# Altium schematic sheet DC_Current_Voltage_Measurement.SchDoc
size A4; SheetNumber: 8; SheetTotal: 10
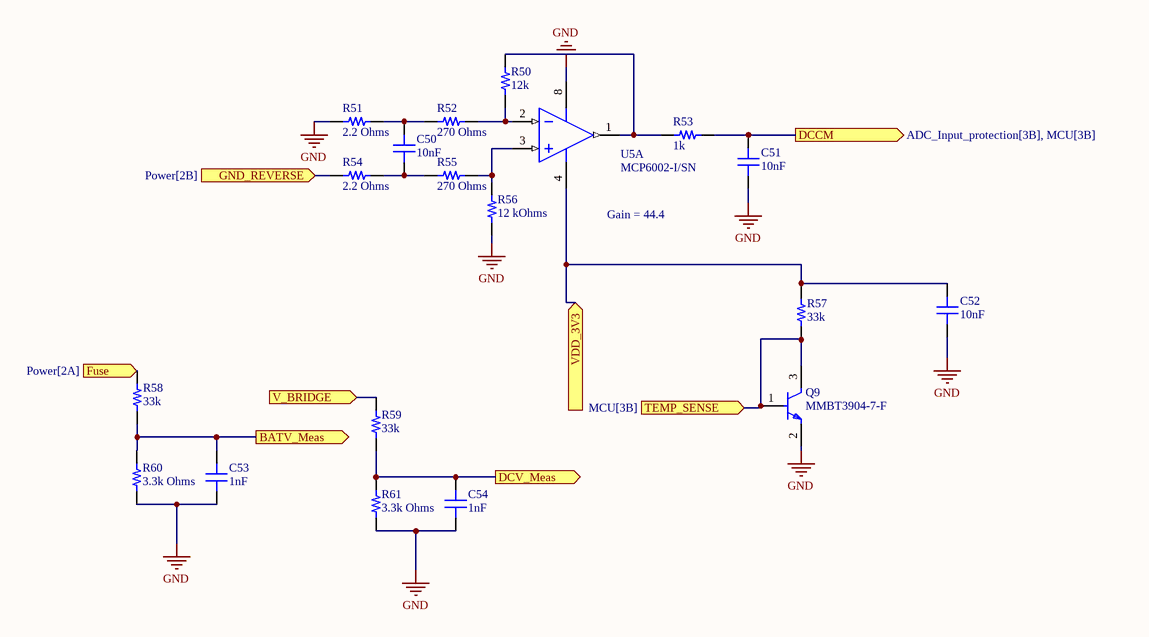
[diagram p0: DC_Current_Voltage_Measurement.SchDoc]

## Parts
C50  10nF  [CAP 0603_1608]
C51  10nF  [CAP 0603_1608]
C52  10nF  [CAP 0603_1608]
C53  1nF  [CAP 0603_1608]
C54  1nF  [CAP 0603_1608]
Q9  MMBT3904-7-F  [FP-SOT23-IPC_A]
R50  12k  [RES 0402_1005]
R51  2.2 Ohms  [RES 0402_1005]
R52  270 Ohms  [RES 0402_1005]
R53  1k  [RES 0402_1005]
R54  2.2 Ohms  [RES 0402_1005]
R55  270 Ohms  [RES 0402_1005]
R56  12 kOhms  [RES 0402_1005]
R57  33k  [RES 0402_1005]
R58  33k  [RES 0402_1005]
R59  33k  [RES 0402_1005]
R60  3.3k Ohms  [RES 0402_1005]
R61  3.3k Ohms  [RES 0402_1005]
U5  MCP6002-I/SN  [SOIC-SN8_M]  (part A of 2)

## Ports
BATV_Meas (out, see ADC_Input_protection[3C], MCU[3C]), DCCM (out, see ADC_Input_protection[3B], MCU[3B]), DCV_Meas (out, see ADC_Input_protection[2C], MCU[3C]), Fuse (in, see Power[2A]), GND_REVERSE (in, see Power[2B]), TEMP_SENSE (in, see MCU[3B]), V_BRIDGE (in, see DC-DC_Buck_Converter+12Vto+3.3V[1A], MotorDrivers[3C], Motors[1A], Power[4A]), VDD_3V3 (in, see ADC_Input_protection[3C], DC-DC_Buck_Converter+12Vto+3.3V[3C], MCU[1B], MotorDrivers[1A], MotorDrivers[1B], Power[2C], ZeroCrossing[1A])

## Nets
GND: C51.1 C52.1 C53.1 C54.1 Q9.2(E) R51.1 R56.1 R60.1 R61.1 U5.8(VDD)
BATV_Meas: C53.2 R58.1 R60.2 ; port BATV_Meas
DCCM: C51.2 R53.2 ; port DCCM
DCV_Meas: C54.2 R59.1 R61.2 ; port DCV_Meas
Fuse: R58.2 ; port Fuse
GND_REVERSE: R54.1 ; port GND_REVERSE
TEMP_SENSE: Q9.1(B) Q9.3(C) R57.1 ; port TEMP_SENSE
V_BRIDGE: R59.2 ; port V_BRIDGE
VDD_3V3: C52.2 R57.2 U5.4(VSS) ; port VDD_3V3
NetC50_1: C50.1 R54.2 R55.1
NetC50_2: C50.2 R51.2 R52.1
NetR50_1: R50.1 R52.2 U5.2(VINA-)
NetR50_2: R50.2 R53.1 U5.1(VOUTA)
NetR55_2: R55.2 R56.2 U5.3(VINA+)

## Notes on the sheet
- Gain = 44.4

## Library data of the parts
C50-C54 = 0603ZC102KAT2A: CAP CER 1000PF 10V X7R 0603; manufacturer: AVX Corporation; Tolerance: ±10%; Part Number: 0603ZC102KAT2A; Applications: General Purpose; componentlink1description: Datasheet; componentlink1url: http://datasheets.avx.com/X7RDielectric.pdf; componentlink2description: DigiKey Link; componentlink2url: http://digikey.com/product-detail/en/avx-corporation/0603ZC102KAT2A/478-0603ZC102KAT2ACT-ND/11570315; Device Package: 0603 (1608 Metric); lastupdated: 2.09.2020 01:02:55; Lifecycle Status: Active; Minimum Order: 1; Mounting Type: Surface Mount, MLCC; Operating Temperature: -55°C ~ 125°C; Package / Case: 0603 (1608 Metric); packaging: TapeAndReel; partid: 27370; Part Status: Active; price: 0.01; series: -; Supplier 1: DigiKey; Supplier Part Number 1: 478-0603ZC102KAT2ACT-ND; Temperature Coefficient: X7R; Voltage - Rated: 10V
  C50-C52: Value: 10nF; Capacitance: 10nF
  C53 C54: Value: 1nF; Capacitance: 1nF
Q9 = CMP-2000-04931-2: TRANS NPN 40V 0.2A SMD SOT23-3; Frequency: 300MHz; Power Dissipation: 350mW; Element Configuration: Single; Max Power Dissipation: 300mW; Max Collector Current: 200mA; Collector Emitter Saturation Voltage: 300mV; Number of Elements: 1; hFE Min: 100; Collector Base Voltage (VCBO): 60V; Emitter Base Voltage (VEBO): 6V; Contact Plating: Tin; Package Quantity: 3000; Max Frequency: 300MHz; REACH SVHC: No SVHC; Max Operating Temperature: 150°C; Width: 1.4mm; Collector Emitter Voltage (VCEO): 40V; Voltage Rating (DC): 40V; Radiation Hardening: No; Case/Package: SOT-23; Height: 1mm; Collector Emitter Breakdown Voltage: 40V; Length: 3.05mm; Polarity: NPN; Packaging: Tape and Reel; Number of Pins: 3; Min Operating Temperature: -55°C; Gain Bandwidth Product: 300MHz; Mount: Surface Mount; Weight: 0.000282oz; Continuous Collector Current: 200mA; Transition Frequency: 300MHz; Max Breakdown Voltage: 40V; Lead Free: Lead Free
R50 = ESR01MZPF47R0: ANTI-SURGE CHIP RESISTORS; Manufacturer: Rohm Semiconductor; Power (Watts): 0.2W, 1/5W; Resistance: 12k Ohms; Temperature Coefficient: ±100ppm/°C; Tolerance: ±1%; Part Number: ESR01MZPF47R0; Value: 12k; ComponentLink1Description: Datasheet; ComponentLink1URL: https://fscdn.rohm.com/en/products/databook/datasheet/passive/resistor/chip_resistor/esr-e.pdf; ComponentLink2Description: DigiKey Link; ComponentLink2URL: https://www.digikey.com/en/products/detail/rohm-semiconductor/ESR01MZPF47R0/16180187; Composition: Thick Film; Device Package: 0402 (1005 Metric); Features: Automotive AEC-Q200, Pulse Withstanding; Height - Seated (Max): 0.016" (0.40mm); LastUpdated: 5.10.2023 19:23:22; Lifecycle Status: Active; Minimum Order: 1; Number of Terminations: 2; Operating Temperature: -55°C ~ 155°C; Package / Case: 0402 (1005 Metric); Packaging: TapeAndReel; PartId: 67421; Part Status: Active; Price: 0.03; Ratings: AEC-Q200; Series: ESR; Size / Dimension: 0.039" L x 0.020" W (1.00mm x 0.50mm); Supplier 1: DigiKey; Supplier Part Number 1: 511-ESR01MZPF47R0CT-ND; Supplier Device Package: 0402
R51 R54 R60 R61 = SG73P1EWTTP2R20F: RES 2.2 OHM 1% 1/4W 0402; Manufacturer: KOA Speer Electronics, Inc.; Power (Watts): 0.25W, 1/4W; Temperature Coefficient: ±200ppm/°C; Part Number: SG73P1EWTTP2R20F; ComponentLink1Description: Datasheet; ComponentLink1URL: https://www.koaspeer.com/pdfs/SG73P.pdf; ComponentLink2Description: DigiKey Link; ComponentLink2URL: https://www.digikey.com/en/products/detail/koa-speer-electronics-inc/SG73P1EWTTP2R20F/14316750; Composition: Thick Film; Device Package: 0402 (1005 Metric); Features: Automotive AEC-Q200, Pulse Withstanding; Height - Seated (Max): 0.016" (0.40mm); LastUpdated: 5.10.2023 19:23:22; Lifecycle Status: Active; Minimum Order: 1; Number of Terminations: 2; Operating Temperature: -55°C ~ 155°C; Package / Case: 0402 (1005 Metric); Packaging: TapeAndReel; PartId: 67136; Part Status: Active; Price: 0.01; Ratings: AEC-Q200; Series: SG73P; Size / Dimension: 0.039" L x 0.020" W (1.00mm x 0.50mm); Supplier 1: DigiKey; Supplier Part Number 1: 2019-SG73P1EWTTP2R20FCT-ND; Supplier Device Package: 0402; Tolerance: ±1%
  R51 R54: Value: 2.2 Ohms; Resistance: 2.2 Ohms
  R60 R61: Value: 3.3k Ohms; Resistance: 3.3k Ohms
R52 R55 = RK73H1ETTP2R70F: RES 2.7 OHM 1% 1/10W 0402; Manufacturer: KOA Speer Electronics, Inc.; Power (Watts): 0.1W, 1/10W; Temperature Coefficient: ±200ppm/°C; Part Number: RK73H1ETTP2R70F; Value: 270 Ohms; ComponentLink1Description: Datasheet; ComponentLink1URL: http://www.koaspeer.com/catimages/Products/RK73H/RK73H.pdf; ComponentLink2Description: DigiKey Link; ComponentLink2URL: https://www.digikey.com/en/products/detail/koa-speer-electronics-inc/RK73H1ETTP2R70F/9844612; Composition: Thick Film; Device Package: 0402 (1005 Metric); Features: Automotive AEC-Q200, Moisture Resistant; Height - Seated (Max): 0.016" (0.40mm); LastUpdated: 5.10.2023 19:24:09; Lifecycle Status: Active; Minimum Order: 1; Number of Terminations: 2; Operating Temperature: -55°C ~ 155°C; Package / Case: 0402 (1005 Metric); Packaging: CutTape; PartId: 14375; Part Status: Active; Price: 0.01; Ratings: AEC-Q200; Resistance: 270 Ohms; Series: RK73H; Size / Dimension: 0.039" L x 0.020" W (1.00mm x 0.50mm); Supplier 1: DigiKey; Supplier Part Number 1: 2019-RK73H1ETTP2R70FCT-ND; Supplier Device Package: 0402; Tolerance: ±1%
R53 = ESR01MZPF47R0: ANTI-SURGE CHIP RESISTORS; Manufacturer: Rohm Semiconductor; Power (Watts): 0.2W, 1/5W; Resistance: 1k Ohms; Temperature Coefficient: ±100ppm/°C; Tolerance: ±1%; Part Number: ESR01MZPF47R0; Value: 1k; ComponentLink1Description: Datasheet; ComponentLink1URL: https://fscdn.rohm.com/en/products/databook/datasheet/passive/resistor/chip_resistor/esr-e.pdf; ComponentLink2Description: DigiKey Link; ComponentLink2URL: https://www.digikey.com/en/products/detail/rohm-semiconductor/ESR01MZPF47R0/16180187; Composition: Thick Film; Device Package: 0402 (1005 Metric); Features: Automotive AEC-Q200, Pulse Withstanding; Height - Seated (Max): 0.016" (0.40mm); LastUpdated: 5.10.2023 19:23:22; Lifecycle Status: Active; Minimum Order: 1; Number of Terminations: 2; Operating Temperature: -55°C ~ 155°C; Package / Case: 0402 (1005 Metric); Packaging: TapeAndReel; PartId: 67421; Part Status: Active; Price: 0.03; Ratings: AEC-Q200; Series: ESR; Size / Dimension: 0.039" L x 0.020" W (1.00mm x 0.50mm); Supplier 1: DigiKey; Supplier Part Number 1: 511-ESR01MZPF47R0CT-ND; Supplier Device Package: 0402
R56 = CRGP0402F12K: RES 12K OHM 1% 1/8W 0402; Manufacturer: TE Connectivity Passive Product; Power (Watts): 0.125W, 1/8W; Temperature Coefficient: ±100ppm/°C; Part Number: CRGP0402F12K; Value: 12 kOhms; ComponentLink1Description: Datasheet; ComponentLink1URL: https://www.te.com/commerce/DocumentDelivery/DDEController?Action=srchrtrv&DocNm=9-1773463-9&DocType=DS&DocLang=English; ComponentLink2Description: DigiKey Link; ComponentLink2URL: https://www.digikey.com/en/products/detail/te-connectivity-passive-product/CRGP0402F12K/8576970; Composition: Thick Film; Device Package: 0402 (1005 Metric); Features: Pulse Withstanding; Height - Seated (Max): 0.016" (0.40mm); LastUpdated: 5.10.2023 19:23:42; Lifecycle Status: Active; Minimum Order: 1; Number of Terminations: 2; Operating Temperature: -55°C ~ 155°C; Package / Case: 0402 (1005 Metric); Packaging: TapeAndReel; PartId: 21536; Part Status: Active; Price: 0.01; Resistance: 12 kOhms; Series: CRGP; Size / Dimension: 0.043" L x 0.020" W (1.10mm x 0.50mm); Supplier 1: DigiKey; Supplier Part Number 1: A130368CT-ND; Supplier Device Package: 0402; Tolerance: ±1%
R57-R59 = SG73P1EWTTP2R20F: RES 2.2 OHM 1% 1/4W 0402; Manufacturer: KOA Speer Electronics, Inc.; Power (Watts): 0.25W, 1/4W; Resistance: 33k Ohms; Temperature Coefficient: ±200ppm/°C; Part Number: SG73P1EWTTP2R20F; Value: 33k; ComponentLink1Description: Datasheet; ComponentLink1URL: https://www.koaspeer.com/pdfs/SG73P.pdf; ComponentLink2Description: DigiKey Link; ComponentLink2URL: https://www.digikey.com/en/products/detail/koa-speer-electronics-inc/SG73P1EWTTP2R20F/14316750; Composition: Thick Film; Device Package: 0402 (1005 Metric); Features: Automotive AEC-Q200, Pulse Withstanding; Height - Seated (Max): 0.016" (0.40mm); LastUpdated: 5.10.2023 19:23:22; Lifecycle Status: Active; Minimum Order: 1; Number of Terminations: 2; Operating Temperature: -55°C ~ 155°C; Package / Case: 0402 (1005 Metric); Packaging: TapeAndReel; PartId: 67136; Part Status: Active; Price: 0.01; Ratings: AEC-Q200; Series: SG73P; Size / Dimension: 0.039" L x 0.020" W (1.00mm x 0.50mm); Supplier 1: DigiKey; Supplier Part Number 1: 2019-SG73P1EWTTP2R20FCT-ND; Supplier Device Package: 0402; Tolerance: ±1%
U5 = CMP-0187-00365-3: None; Bandwidth: 1MHz; Number of Elements: 2; Power Supply Rejection Ratio (PSRR): 86dB; Nominal Supply Current: 100uA; Max Supply Voltage: 6V; Input Offset Voltage-Max: 4.5mV; Voltage Gain: 112dB; Input Bias Current: 1pA; Min Supply Voltage: 1.8V; Slew Rate: 0.6V/µs; Operating Supply Voltage: 5.5V; Amplifier Type: GENERAL PURPOSE; Output Current: 23mA; Common Mode Rejection Ratio: 60dB; Gain Bandwidth Product: 1MHz; Min Operating Temperature: -40°C; Supply Current: 100uA; Number of Circuits: 2; Package Quantity: 100; Width: 3.9mm; Technology: CMOS; RoHS Compliant: Yes; Radiation Hardening: No; Mount: Surface Mount; Number of Pins: 8; Length: 4.9mm; Case/Package: SOIC; Number of Channels: 2; Max Operating Temperature: 85°C; Unity Gain Bandwidth Product: 1MHz; Lead Free: Lead Free; Number of Amplifiers: 2; REACH SVHC: No SVHC; Slew Rate-Nom: 0.6V/µs; Height: 1.25mm; Input Offset Voltage (Vos): 4.5mV; Packaging: Rail/Tube